# Altium schematic sheet 13_EEPROM_SW_JTAG.SchDoc
size A4; PageSetup: Record=PageOptions|CenterHorizontal=True|CenterVertical=True|PrintScale=0.97|XCorrection=1.00|YCorrection=1.00|PrintKind=0|BorderSize=5000000|LeftOffset=0|BottomOffset=0|Orientation=2|PaperLength=1000|PaperWidth=1000|Scale=100|PaperSource=7|PrintQuality=-4|MediaType=1|DitherType=10|PaperKind=A4|PrintScaleMode=1
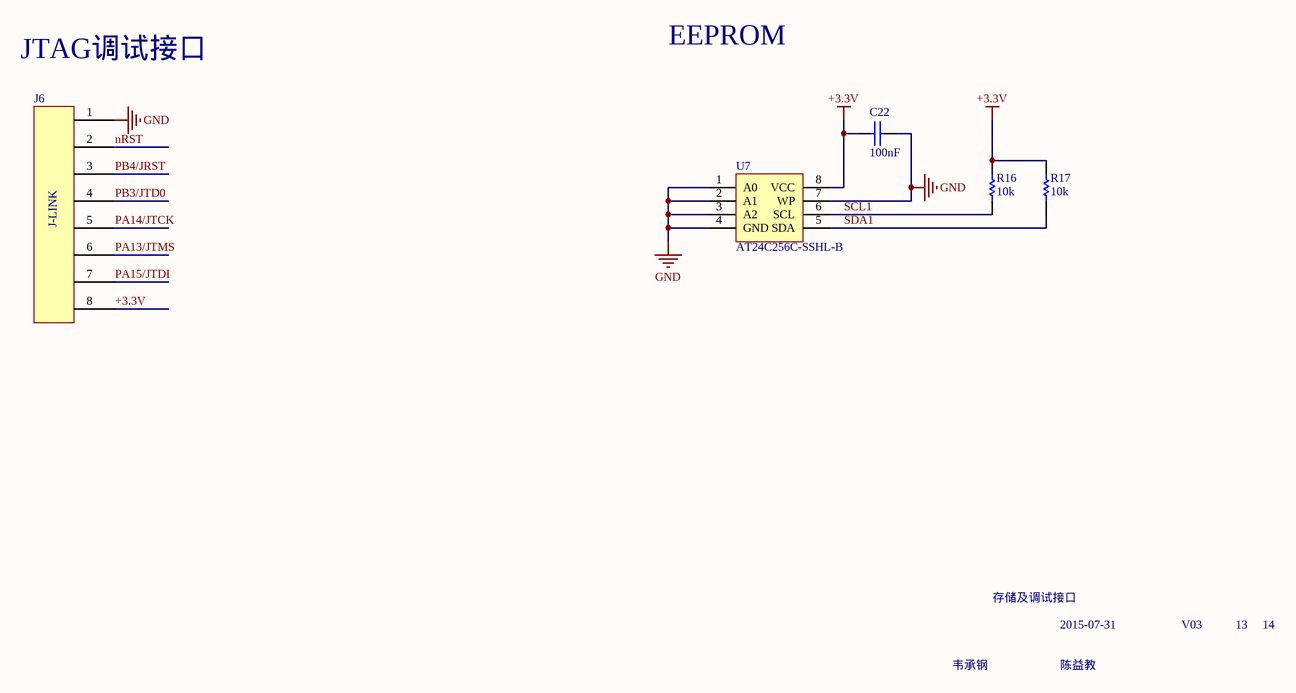
[diagram p0: 13_EEPROM_SW_JTAG.SchDoc]

## Parts
C22  100nF  [0603C]
J6  J-LINK  [JA4/2/3]
R16  10k  [0603R]
R17  10k  [0603R]
U7  AT24C256C-SSHL-B  [SOP8]

## Nets
+3.3V: C22.1 J6.8 R16.2 R17.2 U7.8(VCC)
GND: C22.2 J6.1 U7.1(A0) U7.2(A1) U7.3(A2) U7.4(GND) U7.7(WP)
nRST: J6.2
PA13/JTMS: J6.6
PA14/JTCK: J6.5
PA15/JTDI: J6.7
PB3/JTD0: J6.4
PB4/JRST: J6.3
SCL1: R16.1 U7.6(SCL)
SDA1: R17.1 U7.5(SDA)

## Notes on the sheet
- EEPROM
- JTAG调试接口
- 存储及调试接口
- 2015-07-31
- V03
- 13
- 14
- 韦承钢
- 陈益教
- Shen Zhen Strong Technology Co,.LTD
- 深圳市思榕科技有限公司
- Title:
- PN:
- APPD（核准）:
- Date:
- CHK（审核）:
- DR（绘图）:
- Rev:
- Sheet:
- of
- 梁伟

## Library data of the parts
C22 = CAP
J6 = COM8
R16 R17 = RES
U7 = 24CXX